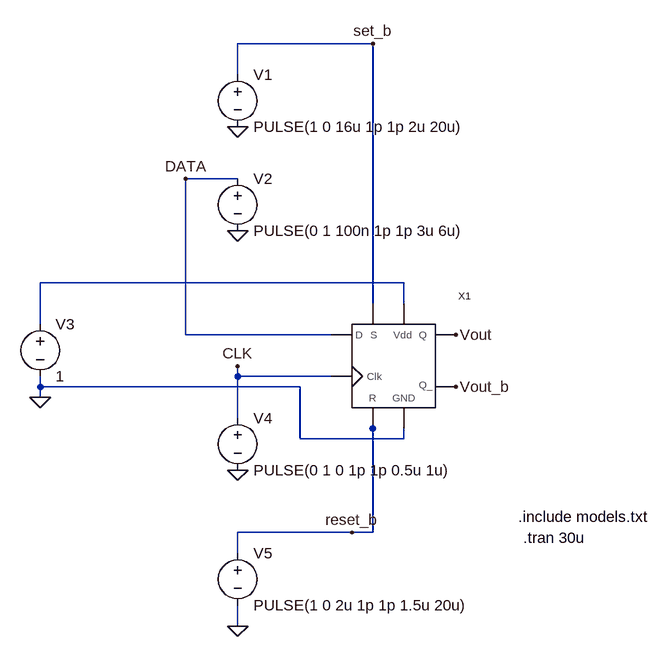
[diagram p0: schematic sim_TI_DFF.asc]
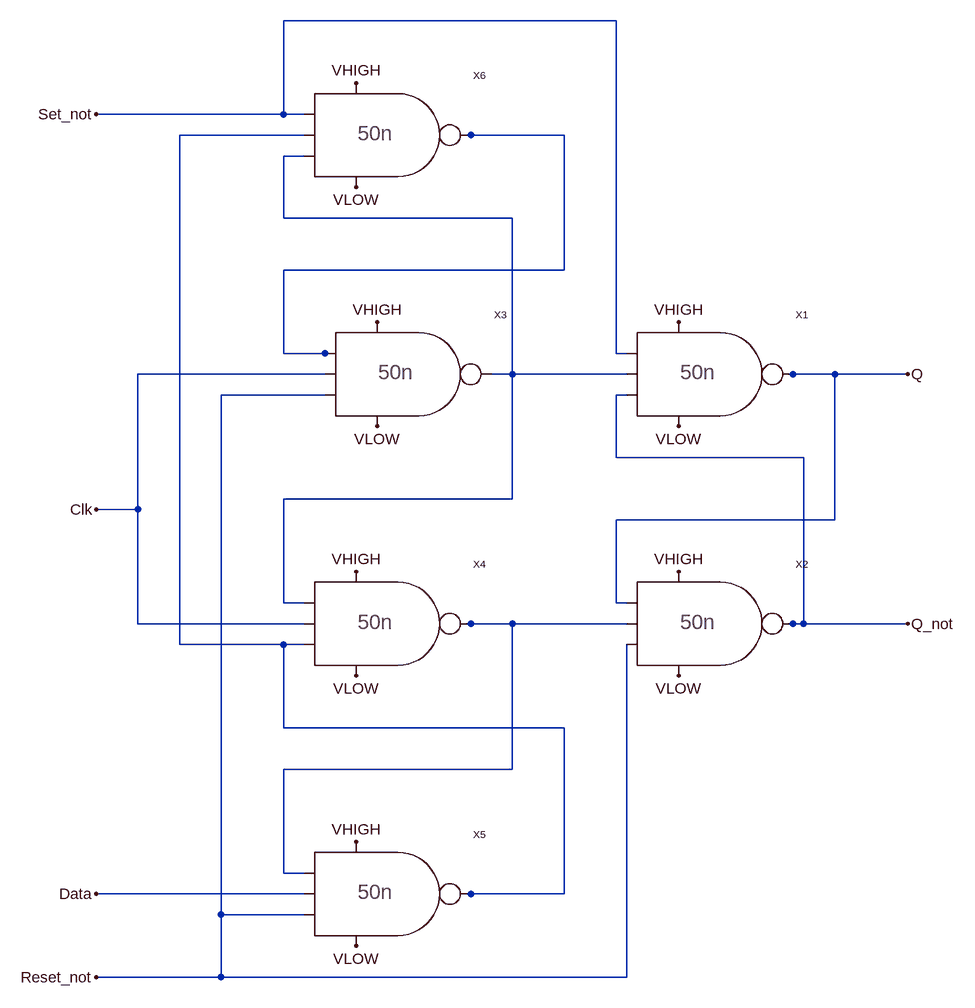
[diagram p1: sub-circuit ti_dff.asc]
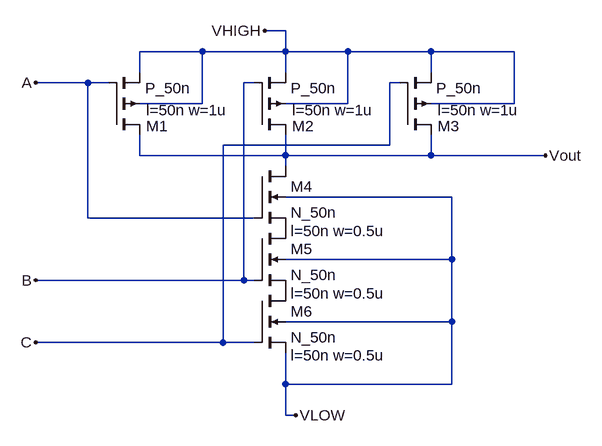
[diagram p2: sub-circuit nand3.asc]
sim_TI_DFF.asc, the LTspice schematic file:
Version 4
SHEET 1 880 680
WIRE 208 -272 0 -272
WIRE 0 -224 0 -272
WIRE 0 -64 -80 -64
WIRE 256 96 -304 96
WIRE 208 128 208 -272
WIRE 256 128 256 96
WIRE -304 160 -304 96
WIRE -80 176 -80 -64
WIRE 144 176 -80 176
WIRE 336 176 304 176
WIRE 0 240 0 224
WIRE 144 240 0 240
WIRE -304 256 -304 240
WIRE 96 256 -304 256
WIRE -304 272 -304 256
WIRE 0 304 0 240
WIRE 208 320 208 304
WIRE 96 336 96 256
WIRE 256 336 256 320
WIRE 256 336 96 336
WIRE 176 480 0 480
WIRE 208 480 208 320
WIRE 208 480 176 480
WIRE 0 512 0 480
WIRE 0 624 0 592
FLAG 0 624 0
FLAG 0 384 0
FLAG -304 272 0
FLAG 0 16 0
FLAG 0 -144 0
FLAG 208 -272 set_b
FLAG -80 -64 DATA
FLAG 0 224 CLK
FLAG 176 480 reset_b
FLAG 336 176 Vout
FLAG 336 256 Vout_b
SYMBOL voltage 0 -240 R0
SYMATTR InstName V1
SYMATTR Value PULSE(1 0 16u 1p 1p 2u 20u)
SYMBOL voltage 0 -80 R0
SYMATTR InstName V2
SYMATTR Value PULSE(0 1 100n 1p 1p 3u 6u)
SYMBOL voltage -304 144 R0
SYMATTR InstName V3
SYMATTR Value 1
SYMBOL voltage 0 288 R0
SYMATTR InstName V4
SYMATTR Value PULSE(0 1 0 1p 1p 0.5u 1u)
SYMBOL voltage 0 496 R0
SYMATTR InstName V5
SYMATTR Value PULSE(1 0 2u 1p 1p 1.5u 20u)
SYMBOL TI_DFF 240 224 R0
SYMATTR InstName X1
TEXT 432 456 Left 2 !.include models.txt
TEXT 440 488 Left 2 !.tran 30u

ti_dff.asc, the sub-circuit schematic file:
Version 4
SHEET 1 1216 1124
WIRE 160 -416 -352 -416
WIRE -352 -272 -352 -416
WIRE -352 -272 -640 -272
WIRE -320 -272 -352 -272
WIRE -320 -240 -512 -240
WIRE -64 -240 -80 -240
WIRE 80 -240 -64 -240
WIRE -320 -208 -352 -208
WIRE -352 -112 -352 -208
WIRE 0 -112 -352 -112
WIRE 80 -32 80 -240
WIRE 80 -32 -352 -32
WIRE -352 96 -352 -32
WIRE -288 96 -352 96
WIRE -272 96 -288 96
WIRE 160 96 160 -416
WIRE 176 96 160 96
WIRE -288 128 -576 128
WIRE 0 128 0 -112
WIRE 0 128 -32 128
WIRE 176 128 0 128
WIRE 432 128 416 128
WIRE 496 128 432 128
WIRE 608 128 496 128
WIRE -288 160 -448 160
WIRE 176 160 160 160
WIRE 160 256 160 160
WIRE 448 256 160 256
WIRE 0 320 0 128
WIRE 0 320 -352 320
WIRE -576 336 -576 128
WIRE -576 336 -640 336
WIRE 496 352 496 128
WIRE 496 352 160 352
WIRE -352 480 -352 320
WIRE -320 480 -352 480
WIRE 160 480 160 352
WIRE 176 480 160 480
WIRE -576 512 -576 336
WIRE -320 512 -576 512
WIRE -64 512 -80 512
WIRE 0 512 -64 512
WIRE 176 512 0 512
WIRE 432 512 416 512
WIRE 448 512 448 256
WIRE 448 512 432 512
WIRE 608 512 448 512
WIRE -512 544 -512 -240
WIRE -352 544 -512 544
WIRE -320 544 -352 544
WIRE -352 672 -352 544
WIRE 80 672 -352 672
WIRE 0 736 0 512
WIRE 0 736 -352 736
WIRE -352 896 -352 736
WIRE -320 896 -352 896
WIRE -320 928 -640 928
WIRE -64 928 -80 928
WIRE 80 928 80 672
WIRE 80 928 -64 928
WIRE -448 960 -448 160
WIRE -320 960 -448 960
WIRE -448 1056 -448 960
WIRE -448 1056 -640 1056
WIRE 176 1056 176 544
WIRE 176 1056 -448 1056
FLAG -640 -272 Set_not
FLAG -640 928 Data
FLAG -640 336 Clk
FLAG -640 1056 Reset_not
FLAG 608 128 Q
FLAG 608 512 Q_not
FLAG -240 848 VHIGH
FLAG -240 432 VHIGH
FLAG 256 432 VHIGH
FLAG -240 -320 VHIGH
FLAG -208 48 VHIGH
FLAG 256 48 VHIGH
FLAG -240 -160 VLOW
FLAG -208 208 VLOW
FLAG 256 208 VLOW
FLAG -240 1008 VLOW
FLAG 256 592 VLOW
FLAG -240 592 VLOW
SYMBOL NAND3 240 128 R0
SYMATTR InstName X1
SYMBOL NAND3 240 512 R0
SYMATTR InstName X2
SYMBOL NAND3 -224 128 R0
SYMATTR InstName X3
SYMBOL NAND3 -256 512 R0
SYMATTR InstName X4
SYMBOL NAND3 -256 928 R0
SYMATTR InstName X5
SYMBOL NAND3 -256 -240 R0
SYMATTR InstName X6

nand3.asc, the sub-circuit schematic file:
Version 4
SHEET 1 880 788
WIRE 320 -96 288 -96
WIRE 192 -64 96 -64
WIRE 320 -64 320 -96
WIRE 320 -64 192 -64
WIRE 416 -64 320 -64
WIRE 544 -64 416 -64
WIRE 672 -64 544 -64
WIRE 96 -32 96 -64
WIRE 320 -32 320 -64
WIRE 544 -32 544 -64
WIRE 16 -16 -64 -16
WIRE 48 -16 16 -16
WIRE 272 -16 256 -16
WIRE 496 -16 480 -16
WIRE 192 16 192 -64
WIRE 192 16 96 16
WIRE 416 16 416 -64
WIRE 416 16 320 16
WIRE 672 16 672 -64
WIRE 672 16 544 16
WIRE 480 80 480 -16
WIRE 480 80 224 80
WIRE 96 96 96 64
WIRE 320 96 320 64
WIRE 320 96 96 96
WIRE 544 96 544 64
WIRE 544 96 320 96
WIRE 720 96 544 96
WIRE 320 112 320 96
WIRE 576 160 320 160
WIRE 16 192 16 -16
WIRE 272 192 16 192
WIRE 576 256 576 160
WIRE 576 256 320 256
WIRE 256 288 256 -16
WIRE 256 288 -64 288
WIRE 272 288 256 288
WIRE 576 352 576 256
WIRE 576 352 320 352
WIRE 224 384 224 80
WIRE 224 384 -64 384
WIRE 272 384 224 384
WIRE 320 448 320 400
WIRE 576 448 576 352
WIRE 576 448 320 448
WIRE 320 496 320 448
WIRE 336 496 320 496
FLAG -64 -16 A
FLAG -64 288 B
FLAG -64 384 C
FLAG 720 96 Vout
FLAG 288 -96 VHIGH
FLAG 336 496 VLOW
SYMBOL pmos4 272 64 M180
WINDOW 0 58 13 Left 2
WINDOW 123 58 38 Left 2
SYMATTR InstName M2
SYMATTR Value2 l=50n w=1u
SYMATTR Value P_50n
SYMBOL pmos4 48 64 M180
WINDOW 0 58 13 Left 2
WINDOW 123 58 38 Left 2
SYMATTR InstName M1
SYMATTR Value2 l=50n w=1u
SYMATTR Value P_50n
SYMBOL pmos4 496 64 M180
WINDOW 0 58 13 Left 2
WINDOW 123 58 38 Left 2
SYMATTR InstName M3
SYMATTR Value2 l=50n w=1u
SYMATTR Value P_50n
SYMBOL nmos4 272 112 R0
WINDOW 123 56 100 Left 2
SYMATTR Value2 l=50n w=0.5u
SYMATTR InstName M4
SYMATTR Value N_50n
SYMBOL nmos4 272 208 R0
WINDOW 123 56 100 Left 2
SYMATTR Value2 l=50n w=0.5u
SYMATTR InstName M5
SYMATTR Value N_50n
SYMBOL nmos4 272 304 R0
WINDOW 123 56 100 Left 2
SYMATTR Value2 l=50n w=0.5u
SYMATTR InstName M6
SYMATTR Value N_50n

The netlist it stands for:
* sim_TI_DFF.asc
V1 set_b 0 PULSE(1 0 16u 1p 1p 2u 20u)
V2 DATA 0 PULSE(0 1 100n 1p 1p 3u 6u)
V3 N001 0 1
V4 CLK 0 PULSE(0 1 0 1p 1p 0.5u 1u)
V5 reset_b 0 PULSE(1 0 2u 1p 1p 1.5u 20u)
XX1 set_b CLK DATA reset_b Vout Vout_b 0 N001 ti_dff

* block symbol definitions
.subckt ti_dff Set_not Clk Data Reset_not Q Q_not VLOW VHIGH
XX1 Set_not N003 Q_not Q VHIGH VLOW nand3
XX2 Q N004 Reset_not Q_not VHIGH VLOW nand3
XX3 N002 Clk Reset_not N003 VHIGH VLOW nand3
XX4 N003 Clk N001 N004 VHIGH VLOW nand3
XX5 N004 Data Reset_not N001 VHIGH VLOW nand3
XX6 Set_not N001 N003 N002 VHIGH VLOW nand3
.ends ti_dff

.subckt nand3 A B C Vout VHIGH VLOW
M2 Vout B VHIGH VHIGH P_50n l=50n w=1u
M1 Vout A VHIGH VHIGH P_50n l=50n w=1u
M3 Vout C VHIGH VHIGH P_50n l=50n w=1u
M4 Vout A P001 VLOW N_50n l=50n w=0.5u
M5 P001 B P002 VLOW N_50n l=50n w=0.5u
M6 P002 C VLOW VLOW N_50n l=50n w=0.5u
.ends nand3

.model NMOS NMOS
.model PMOS PMOS
.lib standard.mos
.include models.txt
.tran 30u
.backanno
.end